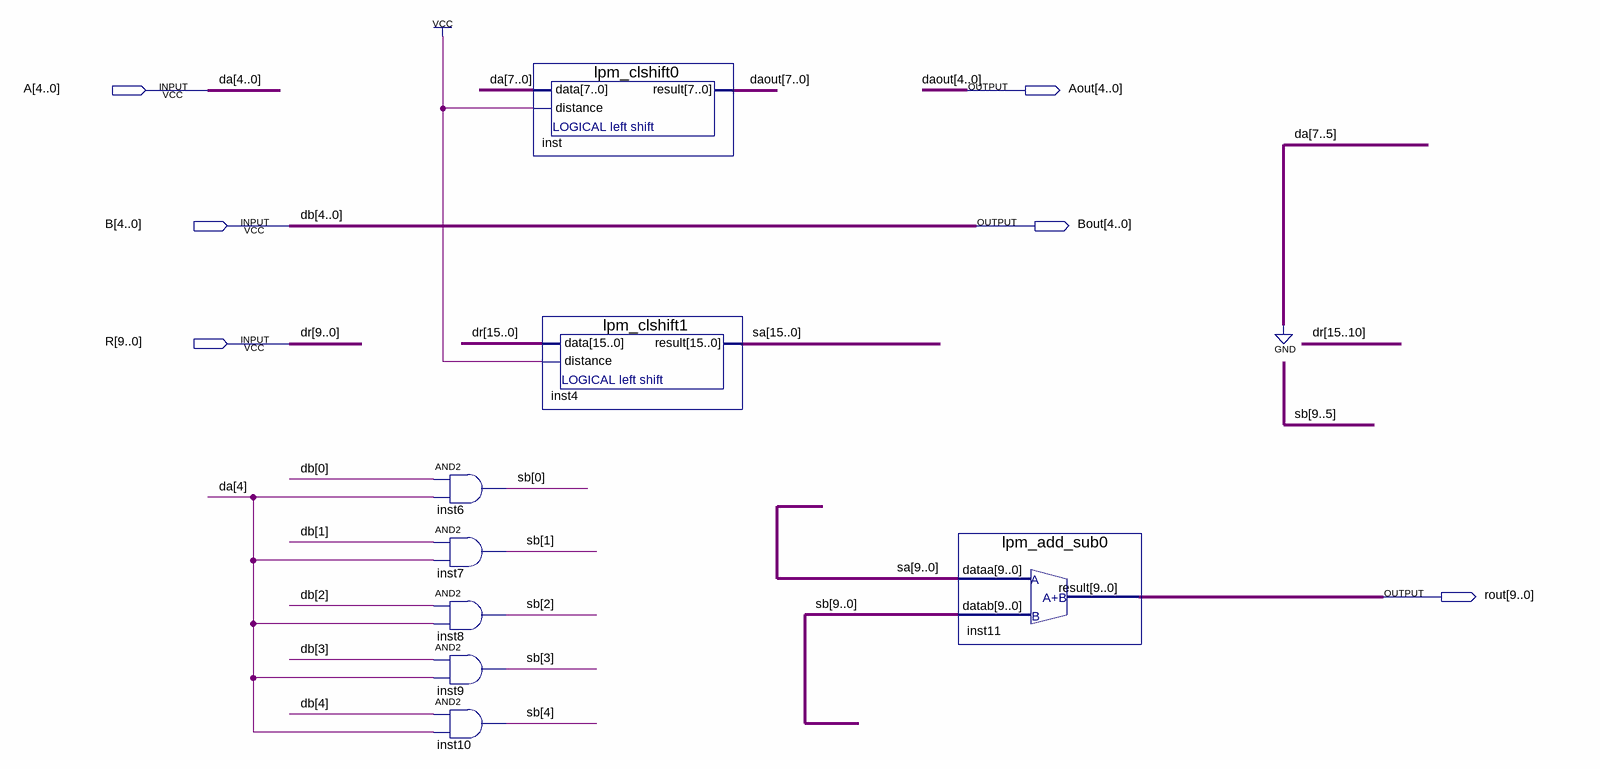
[diagram p0: schematic sheet]
// Quartus schematic block.bdf as structural Verilog: 8 symbols, 6 pins
module block (
  input  [4:0] A,
  input  [4:0] B,
  input  [9:0] R,
  output [4:0] Aout,
  output [4:0] Bout,
  output [9:0] rout
);

  wire [7:5] daout;
  wire [9:0] sb;
  wire [15:0] sa;
  wire [15:10] dr;

  and inst6 (sb[0], B[0], A[4]);
  and inst7 (sb[1], B[1], A[4]);
  and inst8 (sb[2], B[2], A[4]);
  and inst9 (sb[3], B[3], A[4]);
  and inst10 (sb[4], B[4], A[4]);
  lpm_clshift0 inst (.data({3'b000, A}), .distance(1'b1), .result({daout, Aout}));
  lpm_clshift1 inst4 (.data({dr, R}), .distance(1'b1), .result(sa));
  lpm_add_sub0 inst11 (.dataa(sa[9:0]), .datab(sb), .result(rout));

  assign Bout = B;

  // Other names for the same wires on the sheet: da[4:0] = A; daout[4:0] = Aout; db[4:0] = B; dr[9:0] = R
endmodule
